# Altium schematic sheet Sheet_1_2025-07-15.schdoc
size 238 x 141 mm
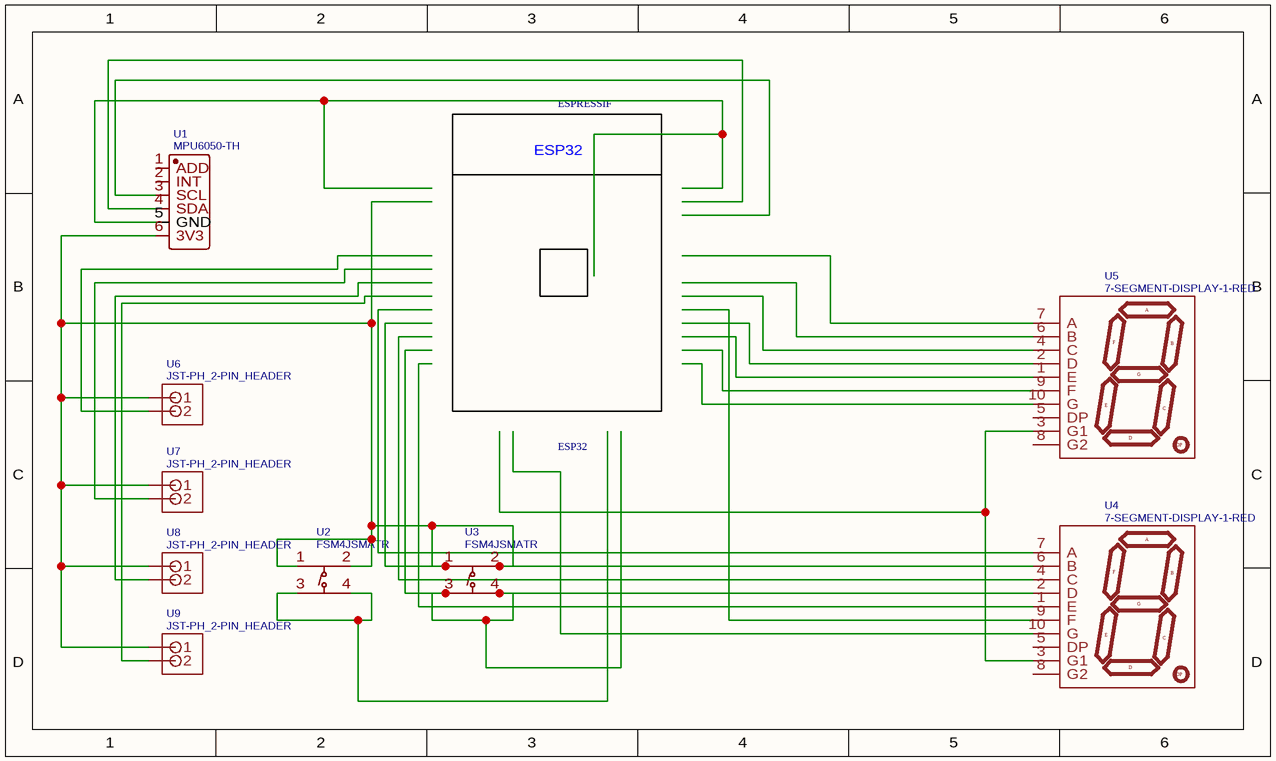
[diagram p0: Sheet_1_2025-07-15.schdoc]

## Parts
U1  MPU6050-TH  [COMM-TH_MPU6050-TH]
U2  FSM4JSMATR  [SW-SMD_4P-L6.0-W6.0-P4.50-LS10.0-1]
U3  FSM4JSMATR  [SW-SMD_4P-L6.0-W6.0-P4.50-LS10.0-1]
U4  7-SEGMENT-DISPLAY-1-RED  [7-SEGMENT-1PTH-EZ]
U5  7-SEGMENT-DISPLAY-1-RED  [7-SEGMENT-1PTH-EZ]
U6  JST-PH_2-PIN_HEADER  [JST_B2B-PH_HEADER]
U7  JST-PH_2-PIN_HEADER  [JST_B2B-PH_HEADER]
U8  JST-PH_2-PIN_HEADER  [JST_B2B-PH_HEADER]
U9  JST-PH_2-PIN_HEADER  [JST_B2B-PH_HEADER]

## Nets
NetU1_6: U1.6(3V3) U2.1 U2.2 U3.1 U3.2 U4.6(B) U6.P1(1) U7.P1(1) U8.P1(1) U9.P1(1) U9.P2(2)
NetU2_3: U2.3 U2.4
NetU3_3: U3.3 U3.4 U4.2(D)
NetU4_3: U4.3(G1) U5.3(G1)

Not connected (* = marked no-connect by the designer): U1 1(ADD) 2(INT) 3(SCL) 4(SDA) 5(GND); U4 1(E) 4(C) 5(DP) 7(A) 8(G2) 9(F) 10(G); U5 1(E) 2(D) 4(C) 5(DP) 6(B) 7(A) 8(G2) 9(F) 10(G); U6 P2(2); U7 P2(2); U8 P2(2)

## Notes on the sheet
- ESPRESSIF
- ESP32

## Library data of the parts
U1 = MPU6050-TH: Manufacturer: null; Contributor: lcsc; Supplier: LCSC; Supplier Part: C9900132629; Manufacturer Part: MPU6050-TH; spicePre: U; spiceSymbolName: MPU6050-TH
U2 U3 = FSM4JSMATR: Manufacturer: TE Connectivity(泰科电子); Contributor: lcsc; Supplier: LCSC; Supplier Part: C2680629; Manufacturer Part: FSM4JSMATR; JLCPCB Part Class: Extended Part; spicePre: U; spiceSymbolName: FSM4JSMATR
U4 U5 = 7-SEGMENT-DISPLAY-1-RED: Contributor: SparkFun; spicePre: U; spiceSymbolName: 7-SEGMENT-DISPLAY-1-RED
U6-U9 = JST-PH_2-PIN_HEADER: spicePre: U; spiceSymbolName: JST-PH_2-PIN_HEADER